# Altium schematic sheet MR_Motor_Control.SchDoc
size A4; CompanyName: BeeIonic; SheetNumber: 3; SheetTotal: 7
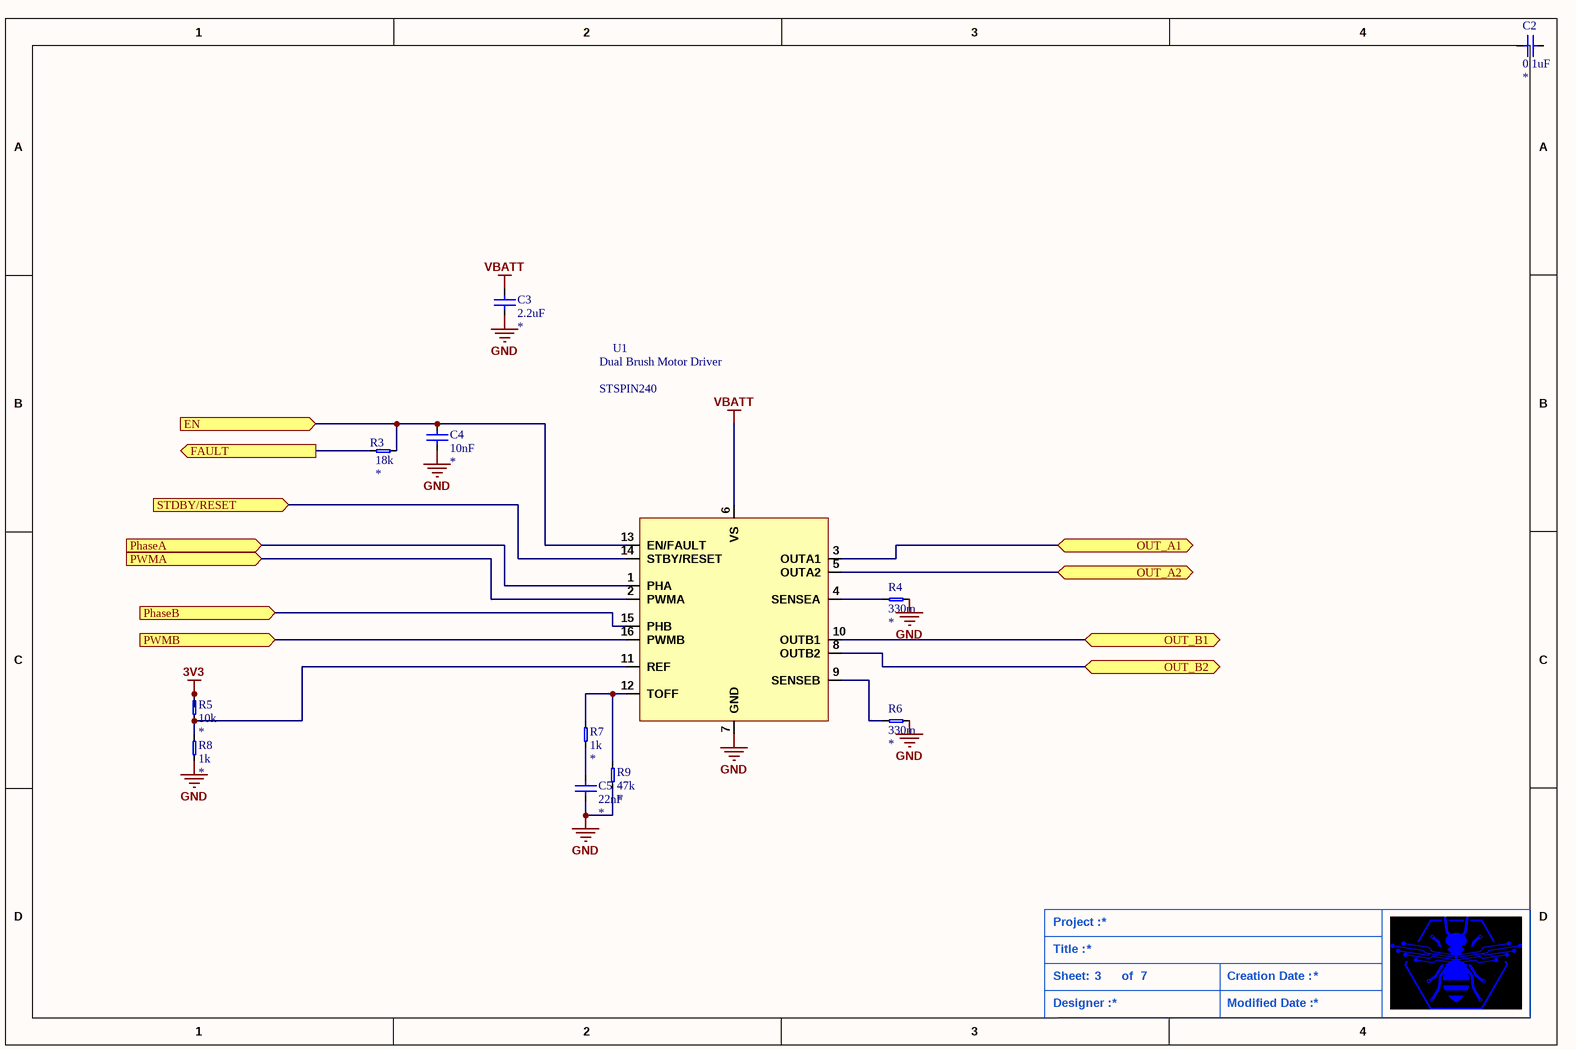
[diagram p0: MR_Motor_Control.SchDoc]

## Parts
C2  value 0.1uF  [0603_CAP_LD]  (hidden comment: CerCap)
C3  value 2.2uF  [0603_CAP_LD]  (hidden comment: CerCap)
C4  value 10nF  [0603_CAP_LD]  (hidden comment: CerCap)
C5  value 22nF  [0603_CAP_LD]  (hidden comment: CerCap)
R3  value 18k  [0603_RES_LD]  (hidden comment: Resistor)
R4  value 330m  [0603_RES_LD]  (hidden comment: Resistor)
R5  value 10k  [0603_RES_LD]  (hidden comment: Resistor)
R6  value 330m  [0603_RES_LD]  (hidden comment: Resistor)
R7  value 1k  [0603_RES_LD]  (hidden comment: Resistor)
R8  value 1k  [0603_RES_LD]  (hidden comment: Resistor)
R9  value 47k  [0603_RES_LD]  (hidden comment: Resistor)
U1  Dual Brush Motor Driver  [QFN-STSPIN240]

## Ports
EN (in), FAULT (out), OUT_A1 (bidir), OUT_A2 (bidir), OUT_B1 (bidir), OUT_B2 (bidir), PhaseA (in), PhaseB (in), PWMA (in), PWMB (in), STDBY/RESET (in)

## Nets
3V3: R5.2
GND: C3.1 C4.1 C5.1 R4.2 R6.2 R8.1 R9.1 U1.7(GND)
VBATT: C3.2 U1.6(VS)
EN: C4.2 R3.2 U1.13(EN/FAULT) ; port EN
FAULT: R3.1 ; port FAULT
OUT_A1: U1.3(OUTA1) ; port OUT_A1
OUT_A2: U1.5(OUTA2) ; port OUT_A2
OUT_B1: U1.10(OUTB1) ; port OUT_B1
OUT_B2: U1.8(OUTB2) ; port OUT_B2
PhaseA: U1.1(PHA) ; port PhaseA
PhaseB: U1.15(PHB) ; port PhaseB
PWMA: U1.2(PWMA) ; port PWMA
PWMB: U1.16(PWMB) ; port PWMB
STDBY/RESET: U1.14(STBY/RESET) ; port STDBY/RESET
NetC5_2: C5.2 R7.1
NetR4_1: R4.1 U1.4(SENSEA)
NetR5_1: R5.1 R8.2 U1.11(REF)
NetR6_1: R6.1 U1.9(SENSEB)
NetR7_2: R7.2 R9.2 U1.12(TOFF)

Not connected (* = marked no-connect by the designer): C2 1 2

## Notes on the sheet
- Project :
- Title :
- Sheet:
- of
- Creation Date :
- Designer :
- Modified Date :

## Library data of the parts
C2-C5 = CerCap: Ceramic Capacitor; Type: *; Voltage/Power: *; Package: *
U1 = STSPIN240: ST Dual Motor Driver; Reference: STSPIN240
R3-R9 = Resistor: Precision: *; Package: *